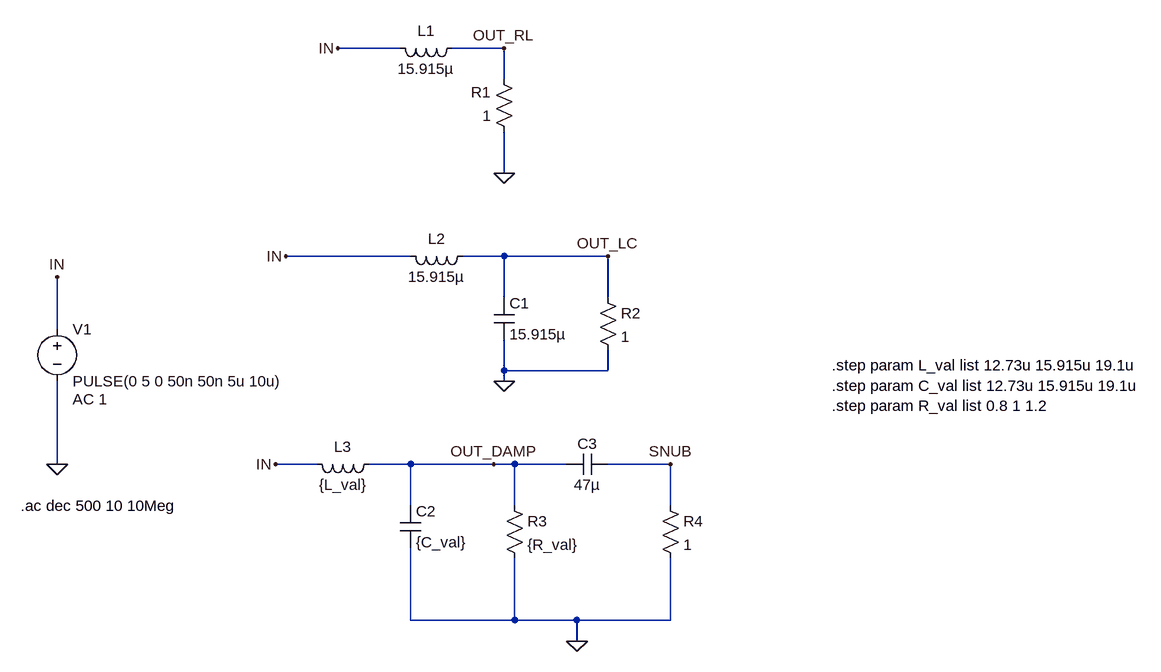
[diagram p0: schematic Low_Pass.asc]
Low_Pass.asc, the LTspice schematic file:
Version 4.1
SHEET 1 1608 1028
WIRE 208 96 112 96
WIRE 368 96 288 96
WIRE 368 144 368 96
WIRE 368 288 368 224
WIRE 224 416 32 416
WIRE 368 416 304 416
WIRE 528 416 368 416
WIRE 368 480 368 416
WIRE 528 480 528 416
WIRE -320 528 -320 448
WIRE 368 592 368 544
WIRE 528 592 528 560
WIRE 528 592 368 592
WIRE 368 608 368 592
WIRE -320 736 -320 608
WIRE 80 736 16 736
WIRE 224 736 160 736
WIRE 352 736 224 736
WIRE 384 736 352 736
WIRE 464 736 384 736
WIRE 624 736 528 736
WIRE 224 800 224 736
WIRE 384 800 384 736
WIRE 624 800 624 736
WIRE 224 976 224 864
WIRE 384 976 384 880
WIRE 384 976 224 976
WIRE 480 976 384 976
WIRE 624 976 624 880
WIRE 624 976 480 976
WIRE 480 1008 480 976
FLAG 368 608 0
FLAG 368 288 0
FLAG 480 1008 0
FLAG -320 736 0
FLAG -320 448 IN
FLAG 32 416 IN
FLAG 16 736 IN
FLAG 112 96 IN
FLAG 368 96 OUT_RL
FLAG 528 416 OUT_LC
FLAG 352 736 OUT_DAMP
FLAG 624 736 SNUB
SYMBOL ind 304 80 R90
WINDOW 0 5 56 VBottom 2
WINDOW 3 32 56 VTop 2
SYMATTR InstName L1
SYMATTR Value 15.915µ
SYMATTR SpiceLine Rser=1m
SYMBOL res 384 240 R180
WINDOW 0 36 76 Left 2
WINDOW 3 36 40 Left 2
SYMATTR InstName R1
SYMATTR Value 1
SYMBOL ind 320 400 R90
WINDOW 0 5 56 VBottom 2
WINDOW 3 32 56 VTop 2
SYMATTR InstName L2
SYMATTR Value 15.915µ
SYMATTR SpiceLine Rser=1m
SYMBOL cap 352 480 R0
SYMATTR InstName C1
SYMATTR Value 15.915µ
SYMBOL res 512 464 R0
SYMATTR InstName R2
SYMATTR Value 1
SYMBOL ind 176 720 R90
WINDOW 0 5 56 VBottom 2
WINDOW 3 32 56 VTop 2
SYMATTR InstName L3
SYMATTR Value {L_val}
SYMATTR SpiceLine Rser=1m
SYMBOL cap 208 800 R0
SYMATTR InstName C2
SYMATTR Value {C_val}
SYMBOL res 368 784 R0
SYMATTR InstName R3
SYMATTR Value {R_val}
SYMBOL cap 528 720 R90
WINDOW 0 0 32 VBottom 2
WINDOW 3 32 32 VTop 2
SYMATTR InstName C3
SYMATTR Value 47µ
SYMBOL res 608 784 R0
SYMATTR InstName R4
SYMATTR Value 1
SYMBOL voltage -320 512 R0
WINDOW 123 24 124 Left 2
WINDOW 39 0 0 Left 0
SYMATTR InstName V1
SYMATTR Value PULSE(0 5 0 50n 50n 5u 10u)
SYMATTR Value2 AC 1
TEXT 872 584 Left 2 !.step param L_val list 12.73u 15.915u 19.1u\n.step param C_val list 12.73u 15.915u 19.1u\n.step param R_val list 0.8 1 1.2
TEXT -376 800 Left 2 !.ac dec 500 10 10Meg

The netlist it stands for:
* Low_Pass.asc
L1 OUT_RL IN 15.915µ Rser=1m
R1 0 OUT_RL 1
L2 OUT_LC IN 15.915µ Rser=1m
C1 OUT_LC 0 15.915µ
R2 OUT_LC 0 1
L3 OUT_DAMP IN {L_val} Rser=1m
C2 OUT_DAMP 0 {C_val}
R3 OUT_DAMP 0 {R_val}
C3 SNUB OUT_DAMP 47µ
R4 SNUB 0 1
V1 IN 0 PULSE(0 5 0 50n 50n 5u 10u) AC 1
.step param L_val list 12.73u 15.915u 19.1u
.step param C_val list 12.73u 15.915u 19.1u
.step param R_val list 0.8 1 1.2
.ac dec 500 10 10Meg
.backanno
.end